# Altium schematic sheet AUDIO_CODEC.SchDoc
size C
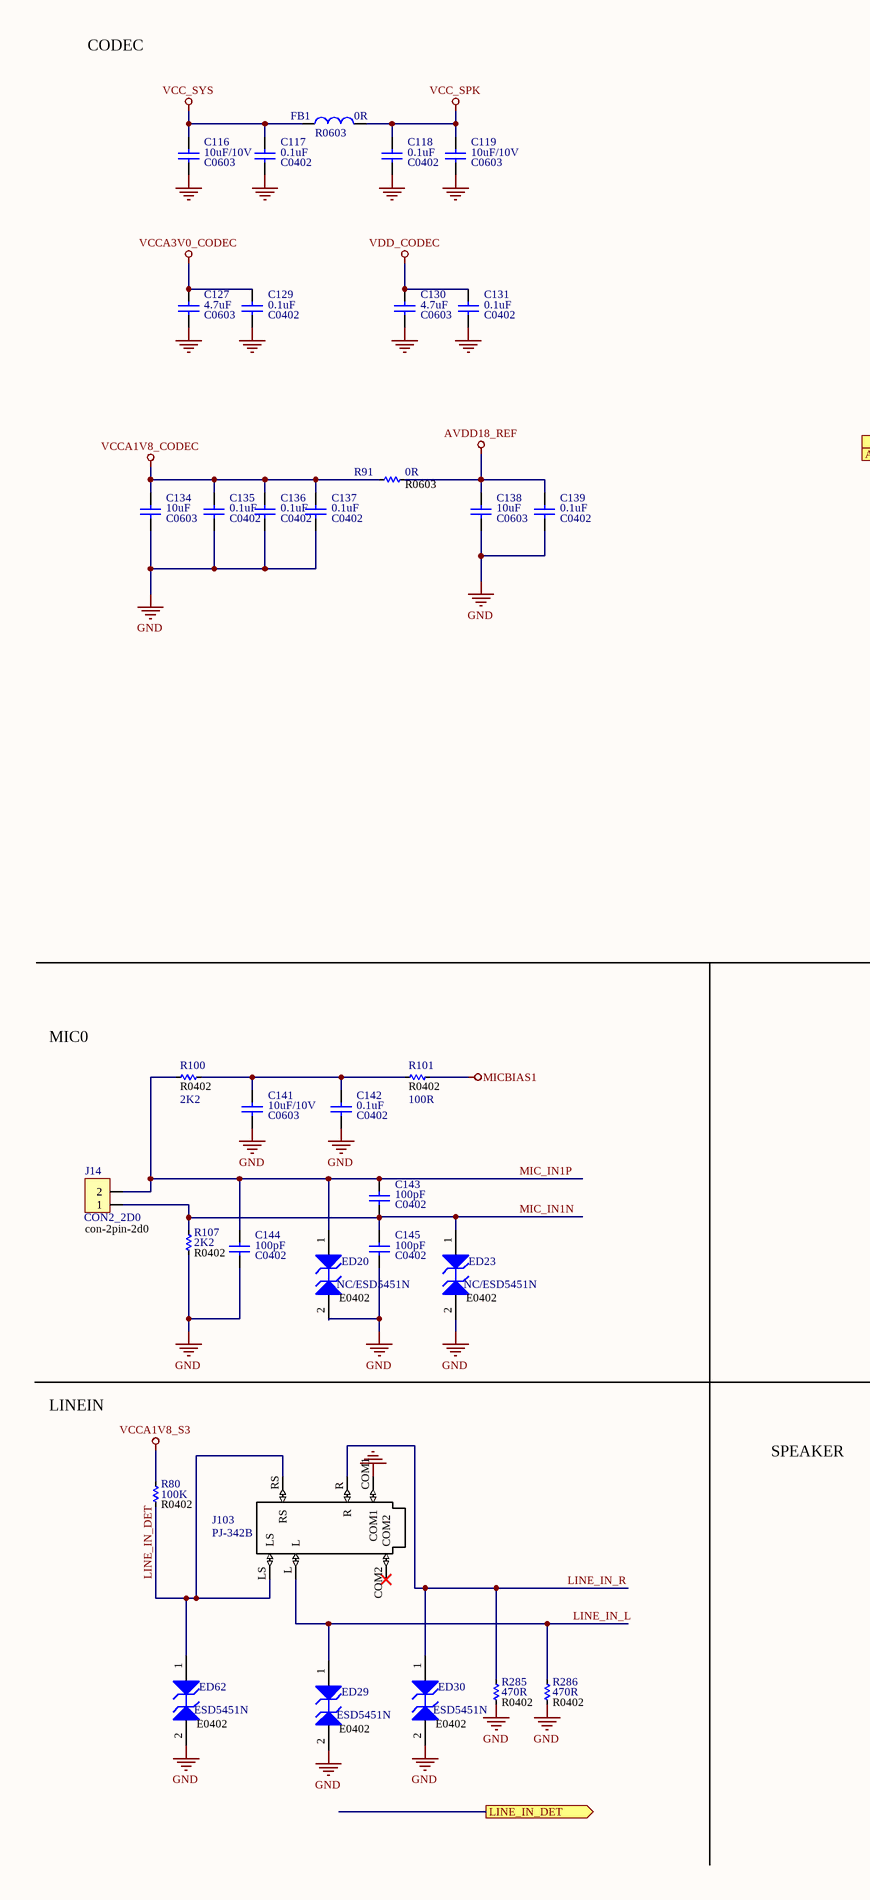
[diagram p0: AUDIO_CODEC.SchDoc, left]
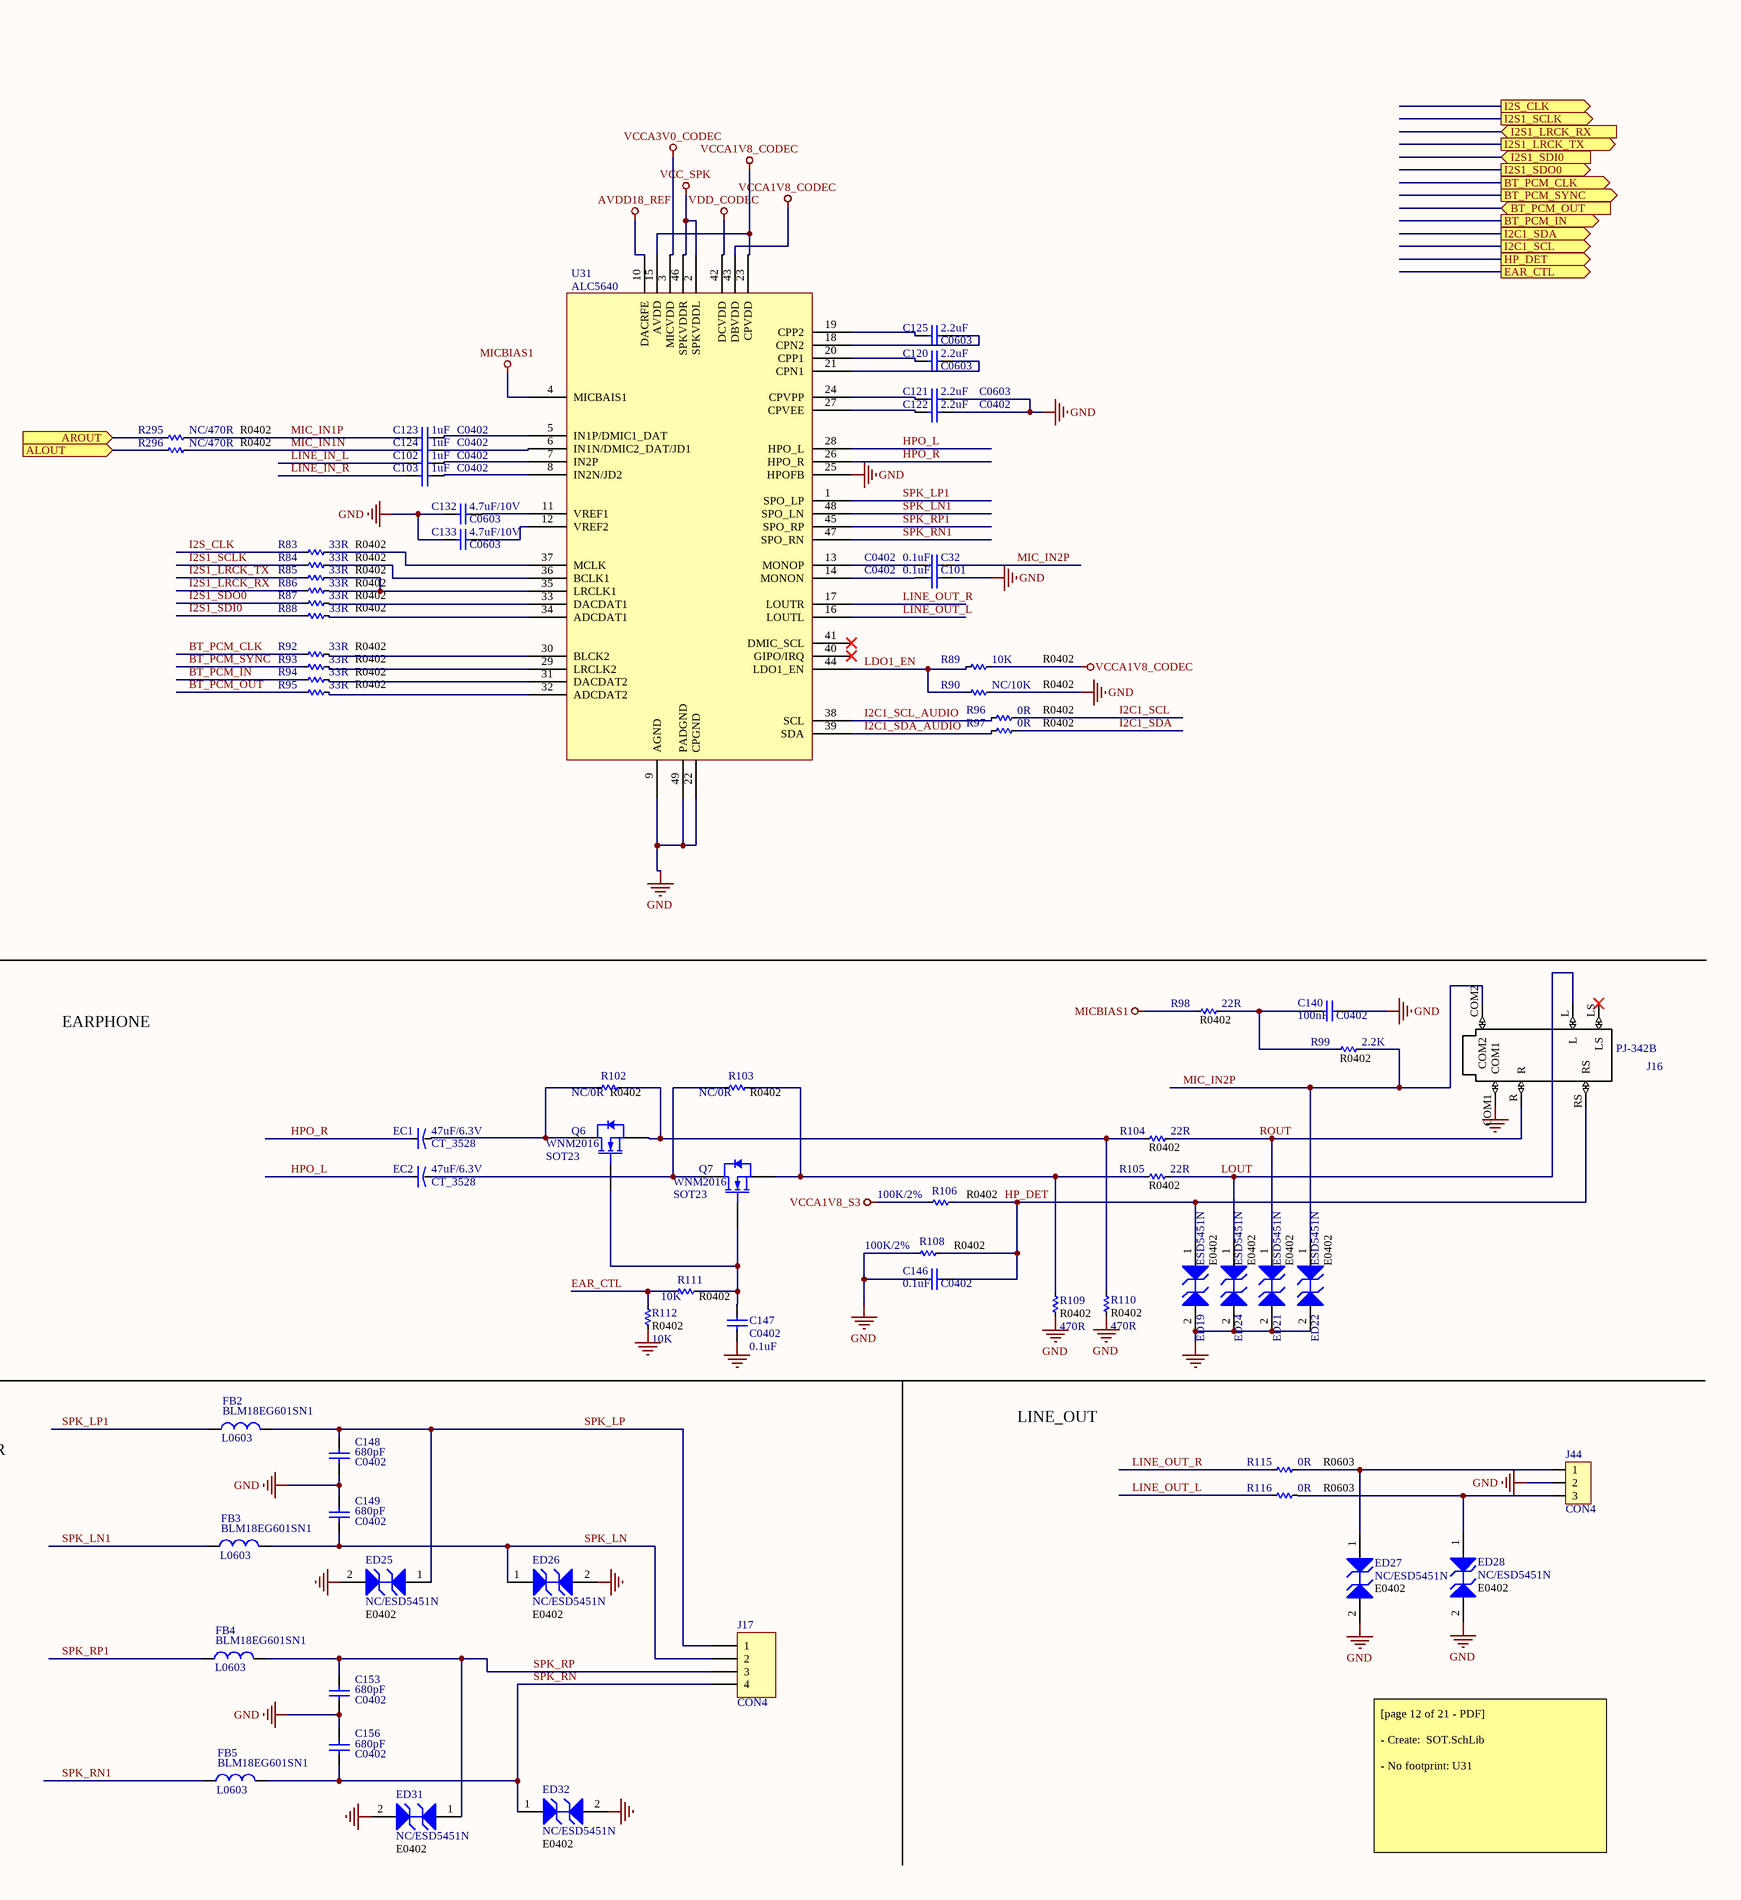
[diagram p1: AUDIO_CODEC.SchDoc, right]

## Parts
C32  C0402  value 0.1uF  [C 0402]
C101  C0402  value 0.1uF  [C 0402]
C102  C0402  value 1uF  [C 0402]
C103  C0402  value 1uF  [C 0402]
C116  C0603  value 10uF/10V  [C 0603]
C117  C0402  value 0.1uF  [C 0402]
C118  C0402  value 0.1uF  [C 0402]
C119  C0603  value 10uF/10V  [C 0603]
C120  C0603  value 2.2uF  [C 0603]
C121  C0603  value 2.2uF  [C 0603]
C122  C0402  value 2.2uF  [C 0402]
C123  C0402  value 1uF  [C 0402]
C124  C0402  value 1uF  [C 0402]
C125  C0603  value 2.2uF  [C 0603]
C127  C0603  value 4.7uF  [C 0603]
C129  C0402  value 0.1uF  [C 0402]
C130  C0603  value 4.7uF  [C 0603]
C131  C0402  value 0.1uF  [C 0402]
C132  C0603  value 4.7uF/10V  [C 0603]
C133  C0603  value 4.7uF/10V  [C 0603]
C134  C0603  value 10uF  [C 0603]
C135  C0402  value 0.1uF  [C 0402]
C136  C0402  value 0.1uF  [C 0402]
C137  C0402  value 0.1uF  [C 0402]
C138  C0603  value 10uF  [C 0603]
C139  C0402  value 0.1uF  [C 0402]
C140  C0402  value 100nF  [C 0402]
C141  C0603  value 10uF/10V  [C 0603]
C142  C0402  value 0.1uF  [C 0402]
C143  C0402  value 100pF  [C 0402]
C144  C0402  value 100pF  [C 0402]
C145  C0402  value 100pF  [C 0402]
C146  C0402  value 0.1uF  [C 0402]
C147  C0402  value 0.1uF  [C 0402]
C148  C0402  value 680pF  [C 0402]
C149  C0402  value 680pF  [C 0402]
C153  C0402  value 680pF  [C 0402]
C156  C0402  value 680pF  [C 0402]
EC1  value 47uF/6.3V  Package: CT_3528  [CAP-ALU-SMD-4.5x5x1.4]  (hidden comment: CN-ALU-SMD)
EC2  value 47uF/6.3V  Package: CT_3528  [CAP-ALU-SMD-4.5x5x1.4]  (hidden comment: CN-ALU-SMD)
ED19  ESD5451N  [DFN1006-2L]
ED20  NC/ESD5451N  [DFN1006-2L]
ED21  ESD5451N  [DFN1006-2L]
ED22  ESD5451N  [DFN1006-2L]
ED23  NC/ESD5451N  [DFN1006-2L]
ED24  ESD5451N  [DFN1006-2L]
ED25  NC/ESD5451N  [DFN1006-2L]
ED26  NC/ESD5451N  [DFN1006-2L]
ED27  NC/ESD5451N  [DFN1006-2L]
ED28  NC/ESD5451N  [DFN1006-2L]
ED29  ESD5451N  [DFN1006-2L]
ED30  ESD5451N  [DFN1006-2L]
ED31  NC/ESD5451N  [DFN1006-2L]
ED32  NC/ESD5451N  [DFN1006-2L]
ED62  ESD5451N  [DFN1006-2L]
FB1  R0603  [L/0.4]
FB2  L0603  [L/0.4]
FB3  L0603  [L/0.4]
FB4  L0603  [L/0.4]
FB5  L0603  [L/0.4]
J14  CON2_2D0  [Header2]
J16  PJ-342B  [*SUNTECH_ST-PJ-312_ST-PJ-312(Primary)]
J17  CON4  [CON4]
J44  CON4  [Header3]
J103  PJ-342B  [*SUNTECH_ST-PJ-312_ST-PJ-312(Primary)]
Q6  WNM2016  [SOT23]
Q7  WNM2016  [SOT23]
R80  R0402  value 100K  [R 0402]
R83  R0402  value 33R  [R 0402]
R84  R0402  value 33R  [R 0402]
R85  R0402  value 33R  [R 0402]
R86  R0402  value 33R  [R 0402]
R87  R0402  value 33R  [R 0402]
R88  R0402  value 33R  [R 0402]
R89  R0402  value 10K  [R 0402]
R90  R0402  value NC/10K  [R 0402]
R91  R0603  value 0R  [R 0603]
R92  R0402  value 33R  [R 0402]
R93  R0402  value 33R  [R 0402]
R94  R0402  value 33R  [R 0402]
R95  R0402  value 33R  [R 0402]
R96  R0402  value 0R  [R 0402]
R97  R0402  value 0R  [R 0402]
R98  R0402  value 22R  [R 0402]
R99  R0402  value 2.2K  [R 0402]
R100  R0402  value 2K2  [R 0402]
R101  R0402  value 100R  [R 0402]
R102  R0402  value NC/0R  [R 0402]
R103  R0402  value NC/0R  [R 0402]
R104  R0402  value 22R  [R 0402]
R105  R0402  value 22R  [R 0402]
R106  R0402  value 100K/2%  [R 0402]
R107  R0402  value 2K2  [R 0402]
R108  R0402  value 100K/2%  [R 0402]
R109  R0402  value 470R  [R 0402]
R110  R0402  value 470R  [R 0402]
R111  R0402  value 10K  [R 0402]
R112  R0402  value 10K  [R 0402]
R115  R0603  value 0R  [R 0603]
R116  R0603  value 0R  [R 0603]
R285  R0402  value 470R  [R 0402]
R286  R0402  value 470R  [R 0402]
R295  R0402  value NC/470R  [R 0402]
R296  R0402  value NC/470R  [R 0402]
U31  ALC5640  [QFN48]

## Ports
ALOUT (in), AROUT (in), BT_PCM_CLK (out), BT_PCM_IN (out), BT_PCM_OUT (in), BT_PCM_SYNC (out), EAR_CTL (out), HP_DET (out), I2C1_SCL (out), I2C1_SDA (out), I2S1_LRCK_RX (in), I2S1_LRCK_TX (out), I2S1_SCLK (out), I2S1_SDI0 (in), I2S1_SDO0 (out), I2S_CLK (out), LINE_IN_DET (out)

## Nets
AVDD18_REF: C138.1 C139.1 R91.2 U31.10(DACRFE)
GND: C101.2 C116.2 C117.2 C118.2 C119.2 C121.2 C122.2 C127.2 C129.2 C130.2 C131.2 C132.1 C133.1 C134.2 C135.2 C136.2 C137.2 C138.2 C139.2 C140.2 C141.2 C142.2 C144.2 C145.2 C146.1 C147.1 C148.2 C149.1 C153.2 C156.1 ED19.2(A2) ED20.2(A2) ED21.2(A2) ED22.2(A2) ED23.2(A2) ED24.2(A2) ED25.2(A2) ED26.2(A2) ED27.2(A2) ED28.2(A2) ED29.2(A2) ED30.2(A2) ED31.2(A2) ED32.2(A2) ED62.2(A2) J16.COM1 J44.2 J103.COM1 R90.2 R107.2 R108.2 R109.1 R110.1 R112.2 R285.2 R286.2 U31.9(AGND) U31.22(CPGND) U31.25(HPOFB) U31.49(PADGND)
MICBIAS1: R98.2 R101.2 U31.4(MICBAIS1)
VCC_SPK: C118.1 C119.1 FB1.2 U31.2(SPKVDDL) U31.46(SPKVDDR)
VCC_SYS: C116.1 C117.1 FB1.1
VCCA1V8_CODEC: C134.1 C135.1 C136.1 C137.1 R89.2 R91.1 U31.15(AVDD) U31.23(CPVDD) U31.43(DBVDD)
VCCA1V8_S3: R80.1 R106.2
VCCA3V0_CODEC: C127.1 C129.1 U31.3(MICVDD)
VDD_CODEC: C130.1 C131.1 U31.42(DCVDD)
ALOUT: R296.1 ; port ALOUT
AROUT: R295.1 ; port AROUT
BT_PCM_CLK: R92.1
BT_PCM_IN: R94.1
BT_PCM_OUT: R95.1
BT_PCM_SYNC: R93.1
EAR_CTL: R111.2 R112.1
HP_DET: C146.2 ED19.1(A1) J16.RS R106.1 R108.1
HPO_L: EC2.1 U31.28(HPO_L)
HPO_R: EC1.1 U31.26(HPO_R)
I2C1_SCL: R96.2
I2C1_SCL_AUDIO: R96.1 U31.38(SCL)
I2C1_SDA: R97.2
I2C1_SDA_AUDIO: R97.1 U31.39(SDA)
I2S1_LRCK_RX: R86.1
I2S1_LRCK_TX: R85.1
I2S1_SCLK: R84.1
I2S1_SDI0: R88.1
I2S1_SDO0: R87.1
I2S_CLK: R83.1
LDO1_EN: R89.1 R90.1 U31.44(LDO1_EN)
LINE_IN_DET: ED62.1(A1) J103.LS J103.RS R80.2
LINE_IN_L: C102.1 ED29.1(A1) J103.L R286.1
LINE_IN_R: C103.1 ED30.1(A1) J103.R R285.1
LINE_OUT_L: R116.1 U31.16(LOUTL)
LINE_OUT_R: R115.1 U31.17(LOUTR)
LOUT: ED24.1(A1) J16.L R105.1
MIC_IN1N: C124.1 C143.2 C145.1 ED23.1(A1) J14.1 R107.1 R296.2
MIC_IN1P: C123.1 C143.1 C144.1 ED20.1(A1) J14.2 R100.2 R295.2
MIC_IN2P: C32.2 ED22.1(A1) J16.COM2 R99.1
ROUT: ED21.1(A1) J16.R R104.1
SPK_LN: C149.2 ED26.1(A1) FB3.2 J17.2
SPK_LN1: FB3.1 U31.48(SPO_LN)
SPK_LP: C148.1 ED25.1(A1) FB2.2 J17.1
SPK_LP1: FB2.1 U31.1(SPO_LP)
SPK_RN: C156.2 ED32.1(A1) FB5.2 J17.4
SPK_RN1: FB5.1 U31.47(SPO_RN)
SPK_RP: C153.1 ED31.1(A1) FB4.2 J17.3
SPK_RP1: FB4.1 U31.45(SPO_RP)
NetC32_1: C32.1 U31.13(MONOP)
NetC101_1: C101.1 U31.14(MONON)
NetC102_2: C102.2 U31.7(IN2P)
NetC103_2: C103.2 U31.8(IN2N/JD2)
NetC120_1: C120.1 U31.20(CPP1)
NetC120_2: C120.2 U31.21(CPN1)
NetC121_1: C121.1 U31.24(CPVPP)
NetC122_1: C122.1 U31.27(CPVEE)
NetC123_2: C123.2 U31.5(IN1P/DMIC1_DAT)
NetC124_2: C124.2 U31.6(IN1N/DMIC2_DAT/JD1)
NetC125_1: C125.1 U31.19(CPP2)
NetC125_2: C125.2 U31.18(CPN2)
NetC132_2: C132.2 U31.11(VREF1)
NetC133_2: C133.2 U31.12(VREF2)
NetC140_1: C140.1 R98.1 R99.2
NetC141_1: C141.1 C142.1 R100.1 R101.1
NetC147_2: C147.2 Q6.3(G) Q7.3(G) R111.1
NetEC1_2: EC1.2 Q6.1(D) R102.2
NetEC2_2: EC2.2 Q7.1(D) R103.2
NetED27_1: ED27.1(A1) J44.1 R115.2
NetED28_1: ED28.1(A1) J44.3 R116.2
NetQ6_2: Q6.2(S) R102.1 R104.2 R110.2
NetQ7_2: Q7.2(S) R103.1 R105.2 R109.2
NetR83_2: R83.2 U31.37(MCLK)
NetR84_2: R84.2 U31.36(BCLK1)
NetR85_2: R85.2 R86.2 U31.35(LRCLK1)
NetR87_2: R87.2 U31.33(DACDAT1)
NetR88_2: R88.2 U31.34(ADCDAT1)
NetR92_2: R92.2 U31.30(BLCK2)
NetR93_2: R93.2 U31.29(LRCLK2)
NetR94_2: R94.2 U31.31(DACDAT2)
NetR95_2: R95.2 U31.32(ADCDAT2)

Not connected (* = marked no-connect by the designer): J16 LS*; J103 COM2*; U31 40(GIPO/IRQ)* 41(DMIC_SCL)*

## Notes on the sheet
- CODEC
- MIC0
- EARPHONE
- LINEIN
- SPEAKER
- LINE_OUT
- [page 12 of 21 - PDF]
  - Create:  SOT.SchLib
  - No footprint: U31
- (in symbol 1SMB54CAT3) E0402
- (in symbol Header2) con-2pin-2d0
- (in symbol L1) BLM18EG601SN1; 0R

## Library data of the parts
C32 C101-C103 C116-C125 C127 C129-C149 C153 C156 = Cap: Capacitor; Published: 8-Jun-2000; LatestRevisionDate: 17-Jul-2002; LatestRevisionNote: Re-released for DXP Platform.; PackageReference: RAD-0.3; Publisher: Altium Limited; PackageDescription: Radial Cap, Thru-Hole; 2 Leads; 0.3 in Pin Spacing
EC1 EC2 = CN-ALU-SMD: Polarized Capacitor (Axial); Published: 8-Jun-2000; LatestRevisionDate: 17-Jul-2002; LatestRevisionNote: Re-released for DXP Platform.; PackageReference: POLAR0.8; Publisher: Altium Limited
ED19-ED32 ED62 = 1SMB54CAT3: 600 W Peak Power Zener Transient Voltage Suppressor, Bidirectional, 2-Pin SMB, Tape and Reel; Manufacturer: On Semiconductor; IR Max (uA): 5; PPK Max (W): 600; V(BR) Typ (V): 63.16; DatasheetVersion: Rev. A; PackageVersion: Rev. A, 01/2000; PackageReference: SMB-2-403C-01; PackageDescription: 2-Pin Small Molded Package, J-Bend Lead, Body 4.315 x 3.555 mm; Supplier 1: Digi-Key; Supplier Part Number 1: 1SMB54CAT3-ND; Direction: Bidirectional; Packing: Tape and Reel; Mounting Technology: Surface Mount; PartNumber: 1SMB54CAT3; ComponentLink1Description: Manufacturer URL; ComponentLink1URL: http://www.onsemi.com/; ComponentLink2Description: Datasheet; ComponentLink2URL: http://www.onsemi.com/pub_link/Collateral/1SMB10CAT3-D.PDF; ComponentLink3Description: Package Specification; ComponentLink3URL: http://www.onsemi.com/pub_link/Collateral/1SMB10CAT3-D.PDF
FB1-FB5 = L1: Inductor; Value: 150 mH
J14 = Header2: Header IDC, 2 x 1 Pin Vertical 2.54mm Pitch (Non-Boxed, Male); Manufacturer: W¨¹rth Elektronik eiSos GmbH; partNo: 613002143121; ComponentLink1 Description: Manufacturer; ComponentLink2 Description: Datasheet; NoPins: 02; Created Date: 29 March 2013; ComponentLink1URL: http://www.we-online.com; ComponentLink2URL: http://katalog.we-online.de/em/datasheet/6130xx143121.pdf; Created by: Karrer Zheng
J16 J103 = ST-PJ-312: SMD Audio Jack; 3.5mm; MF: Suntech; SnapEDA_Link: https://www.snapeda.com/parts/ST-PJ-312/Suntech/view-part/?ref=snap; Availability: Unavailable; Price: None; Package: None; MP: ST-PJ-312; Value: *
J17 = Header 4: Header, 4-Pin; LatestRevisionDate: 17-Jul-2002; LatestRevisionNote: Re-released for DXP Platform.; Publisher: Altium Limited
J44 = Header3: Header IDC, 3 x 1 Pin Vertical 2.54mm Pitch (Non-Boxed, Male); Manufacturer: W¨¹rth Elektronik eiSos GmbH; partNo: 613002143121; ComponentLink1 Description: Manufacturer; ComponentLink2 Description: Datasheet; NoPins: 02; Created Date: 29 March 2013; ComponentLink1URL: http://www.we-online.com; ComponentLink2URL: http://katalog.we-online.de/em/datasheet/6130xx143121.pdf; Created by: Karrer Zheng
Q6 Q7 = ZXM61N02F: 20V N-Channel Enhancement Mode MOSFET; Published: 17-Dec-2003; DatasheetVersion: May-99; PackageVersion: 1996; PackageReference: SOT23; Publisher: Altium Limited; PackageDescription: SOT-23; 3 Leads; Body 3.1 x 2.5 mm, inc. leads (LxW max), Alternate Lead Configuration; ComponentLink1Description: Manufacturer Link; ComponentLink1URL: http://www.zetex.com/; ComponentLink2Description: Datasheet; ComponentLink2URL: www.zetex.com/3.0/pdf/ZXM61N02F.pdf
R80 R83-R112 R115 R116 R285 R286 R295 R296 = Res-SMD: Resistor; Manufacturer: Generic Components; Class: Passive; Published: 08/06/2000; Publisher: Altium Hobart Technology Centre